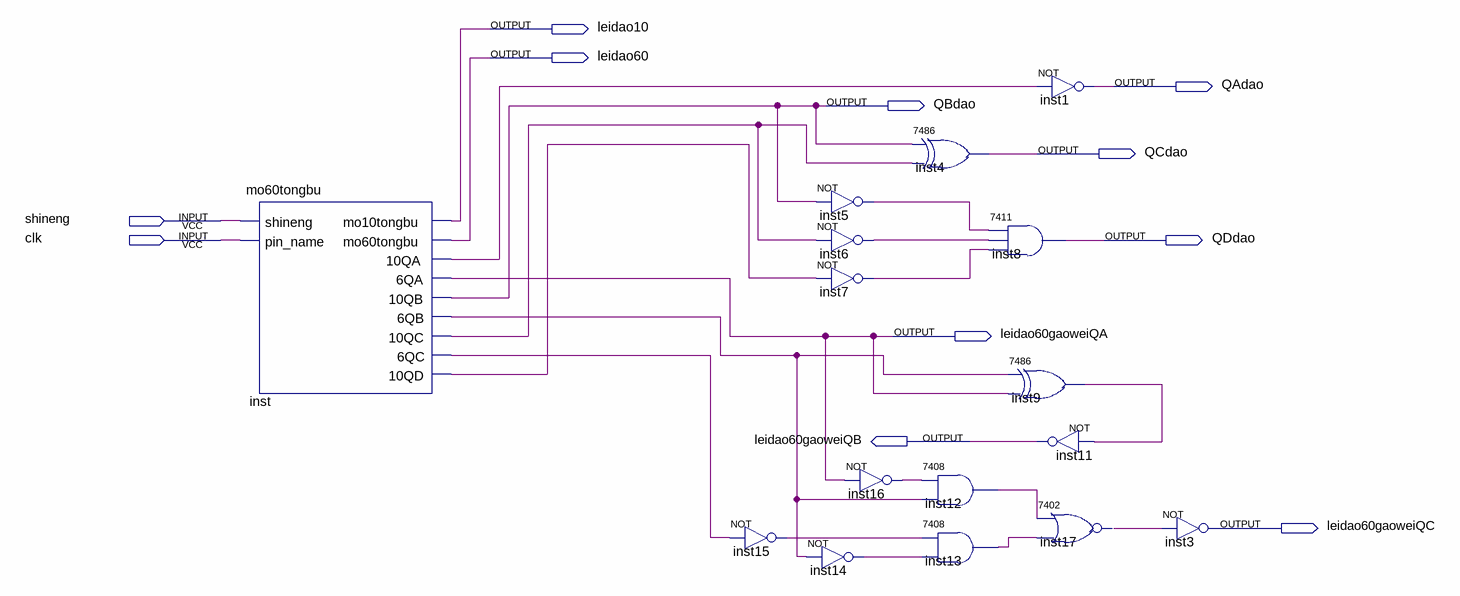
[diagram p0: schematic sheet]
// Quartus schematic leidao60.bdf as structural Verilog: 16 symbols, 11 pins
module leidao60 (
  input  shineng,
  input  clk,
  output leidao10,
  output leidao60,
  output QAdao,
  output QBdao,
  output QCdao,
  output QDdao,
  output leidao60gaoweiQA,
  output leidao60gaoweiQB,
  output leidao60gaoweiQC
);

  wire inst5_out, inst6_out, inst7_out, inst9_1, inst12_1, inst13_1, inst14_out, inst15_out, inst16_out,
       inst17_1, inst_6qb, inst_6qc, inst_10qa, inst_10qc, inst_10qd;

  mo60tongbu inst (
    .shineng(shineng), .pin_name(clk), .mo10tongbu(leidao10), .mo60tongbu(leidao60), .\10QA (inst_10qa),
    .\6QA (leidao60gaoweiQA), .\10QB (QBdao), .\6QB (inst_6qb), .\10QC (inst_10qc), .\6QC (inst_6qc),
    .\10QD (inst_10qd));
  not inst15 (inst15_out, inst_6qc);
  not inst14 (inst14_out, inst_6qb);
  not inst5 (inst5_out, QBdao);
  not inst6 (inst6_out, inst_10qc);
  not inst7 (inst7_out, inst_10qd);
  not inst16 (inst16_out, leidao60gaoweiQA);
  \7486  inst4 (.\2 (QBdao), .\3 (inst_10qc), .\1 (QCdao));
  \7408  inst12 (.\3 (inst_6qb), .\2 (inst16_out), .\1 (inst12_1));
  \7408  inst13 (.\3 (inst14_out), .\2 (inst15_out), .\1 (inst13_1));
  not inst1 (QAdao, inst_10qa);
  \7411  inst8 (.\2 (inst5_out), .\3 (inst6_out), .\4 (inst7_out), .\1 (QDdao));
  \7486  inst9 (.\2 (inst_6qb), .\3 (leidao60gaoweiQA), .\1 (inst9_1));
  not inst11 (leidao60gaoweiQB, inst9_1);
  \7402  inst17 (.\2 (inst12_1), .\3 (inst13_1), .\1 (inst17_1));
  not inst3 (leidao60gaoweiQC, inst17_1);
endmodule
